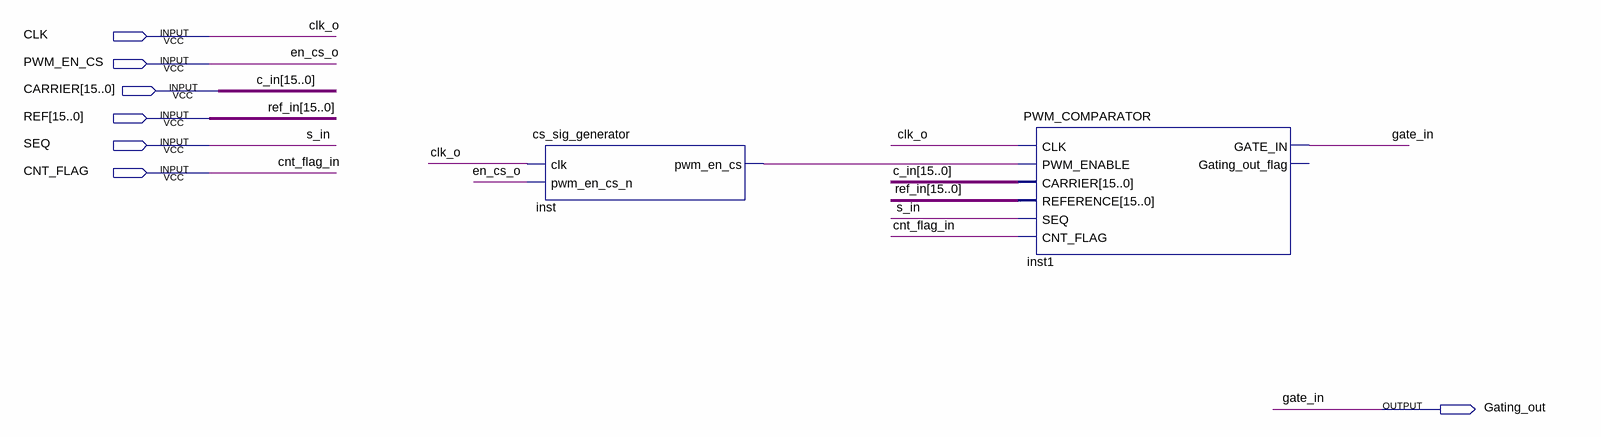
[diagram p0: schematic sheet]
// Quartus schematic PWM3.bdf as structural Verilog: 2 symbols, 7 pins
module PWM3 (
  input  CLK,
  input  PWM_EN_CS,
  input  [15:0] CARRIER,
  input  [15:0] REF,
  input  SEQ,
  input  CNT_FLAG,
  output Gating_out
);

  wire inst_pwm_en_cs;

  cs_sig_generator inst (.clk(CLK), .pwm_en_cs_n(PWM_EN_CS), .pwm_en_cs(inst_pwm_en_cs));
  PWM_COMPARATOR inst1 (
    .CLK(CLK), .PWM_ENABLE(inst_pwm_en_cs), .CARRIER(CARRIER), .REFERENCE(REF), .SEQ(SEQ),
    .CNT_FLAG(CNT_FLAG), .GATE_IN(Gating_out));  // open: Gating_out_flag

  // Other names for the same wires on the sheet: c_in[15:0] = CARRIER; clk_o = CLK; cnt_flag_in = CNT_FLAG;
  //   en_cs_o = PWM_EN_CS; gate_in = Gating_out; ref_in[15:0] = REF; s_in = SEQ
endmodule
